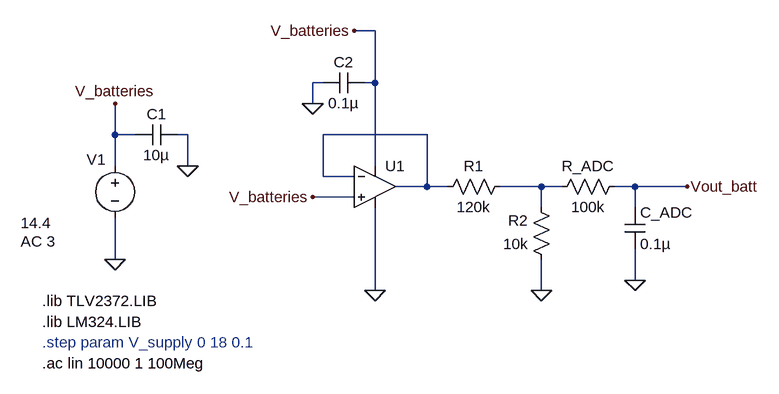
[diagram p0: schematic voltage_meaurementSINGLEbatteries_optimised.asc]
voltage_meaurementSINGLEbatteries_optimised.asc, the LTspice schematic file:
Version 4
SHEET 1 1060 680
WIRE 288 -112 256 -112
WIRE 208 -32 192 -32
WIRE 288 -32 288 -112
WIRE 288 -32 272 -32
WIRE 192 0 192 -32
WIRE -112 48 -112 0
WIRE -80 48 -112 48
WIRE 0 48 -16 48
WIRE 368 48 208 48
WIRE -112 96 -112 48
WIRE 0 96 0 48
WIRE 288 96 288 -32
WIRE 208 112 208 48
WIRE 256 112 208 112
WIRE 368 128 368 48
WIRE 368 128 320 128
WIRE 400 128 368 128
WIRE 544 128 480 128
WIRE 576 128 544 128
WIRE 688 128 656 128
WIRE 768 128 688 128
WIRE 256 144 192 144
WIRE 544 160 544 128
WIRE 688 160 688 128
WIRE -112 240 -112 176
WIRE 688 272 688 224
WIRE 288 288 288 160
WIRE 544 288 544 240
FLAG 768 128 Vout_batt
FLAG 256 -112 V_batteries
FLAG 288 288 0
FLAG 192 144 V_batteries
FLAG 544 288 0
FLAG -112 240 0
FLAG -112 0 V_batteries
FLAG 0 96 0
FLAG 192 0 0
FLAG 688 272 0
SYMBOL res 496 112 R90
WINDOW 0 0 56 VBottom 2
WINDOW 3 32 56 VTop 2
SYMATTR InstName R1
SYMATTR Value 120k
SYMATTR SpiceLine tol=1 pwr=0.6
SYMBOL res 560 256 R180
WINDOW 0 36 76 Left 2
WINDOW 3 36 40 Left 2
SYMATTR InstName R2
SYMATTR Value 10k
SYMATTR SpiceLine tol=1 pwr=0.6
SYMBOL OpAmps\\opamp2 288 64 R0
WINDOW 3 16 96 Invisible 2
SYMATTR InstName U1
SYMATTR Value2 TLV2372
SYMBOL voltage -112 80 R0
WINDOW 0 -14 6 Right 2
WINDOW 3 -145 104 Left 2
WINDOW 123 -145 132 Left 2
WINDOW 39 0 0 Left 0
SYMATTR InstName V1
SYMATTR Value 14.4
SYMATTR Value2 AC 3
SYMBOL cap -16 32 R90
WINDOW 0 0 32 VBottom 2
WINDOW 3 32 32 VTop 2
SYMATTR InstName C1
SYMATTR Value 10µ
SYMBOL cap 272 -48 R90
WINDOW 0 0 32 VBottom 2
WINDOW 3 32 32 VTop 2
SYMATTR InstName C2
SYMATTR Value 0.1µ
SYMBOL cap 672 160 R0
SYMATTR InstName C_ADC
SYMATTR Value 0.1µ
SYMBOL res 672 112 R90
WINDOW 0 0 56 VBottom 2
WINDOW 3 32 56 VTop 2
SYMATTR InstName R_ADC
SYMATTR Value 100k
TEXT -224 368 Left 2 ;.step param V_supply 0 18 0.1
TEXT -224 304 Left 2 !.lib TLV2372.LIB
TEXT -224 336 Left 2 !.lib LM324.LIB
TEXT -224 400 Left 2 !.ac lin 10000 1 100Meg

The netlist it stands for:
* voltage_meaurementSINGLEbatteries_optimised.asc
R1 N002 N001 120k tol=1 pwr=0.6
R2 0 N002 10k tol=1 pwr=0.6
XU1 V_batteries N001 V_batteries 0 N001 opamp2 TLV2372  ; pins In+ In- V+ V- OUT
V1 V_batteries 0 14.4 AC 3
C1 0 V_batteries 10µ
C2 V_batteries 0 0.1µ
C_ADC Vout_batt 0 0.1µ
R_ADC Vout_batt N002 100k
* .step param V_supply 0 18 0.1
.lib TLV2372.LIB
.lib LM324.LIB
.ac lin 10000 1 100Meg
.backanno
.end